# Altium schematic sheet Schematic_Rev2.SchDoc
size A4; Revision: 4; SheetNumber: 1; SheetTotal: 1
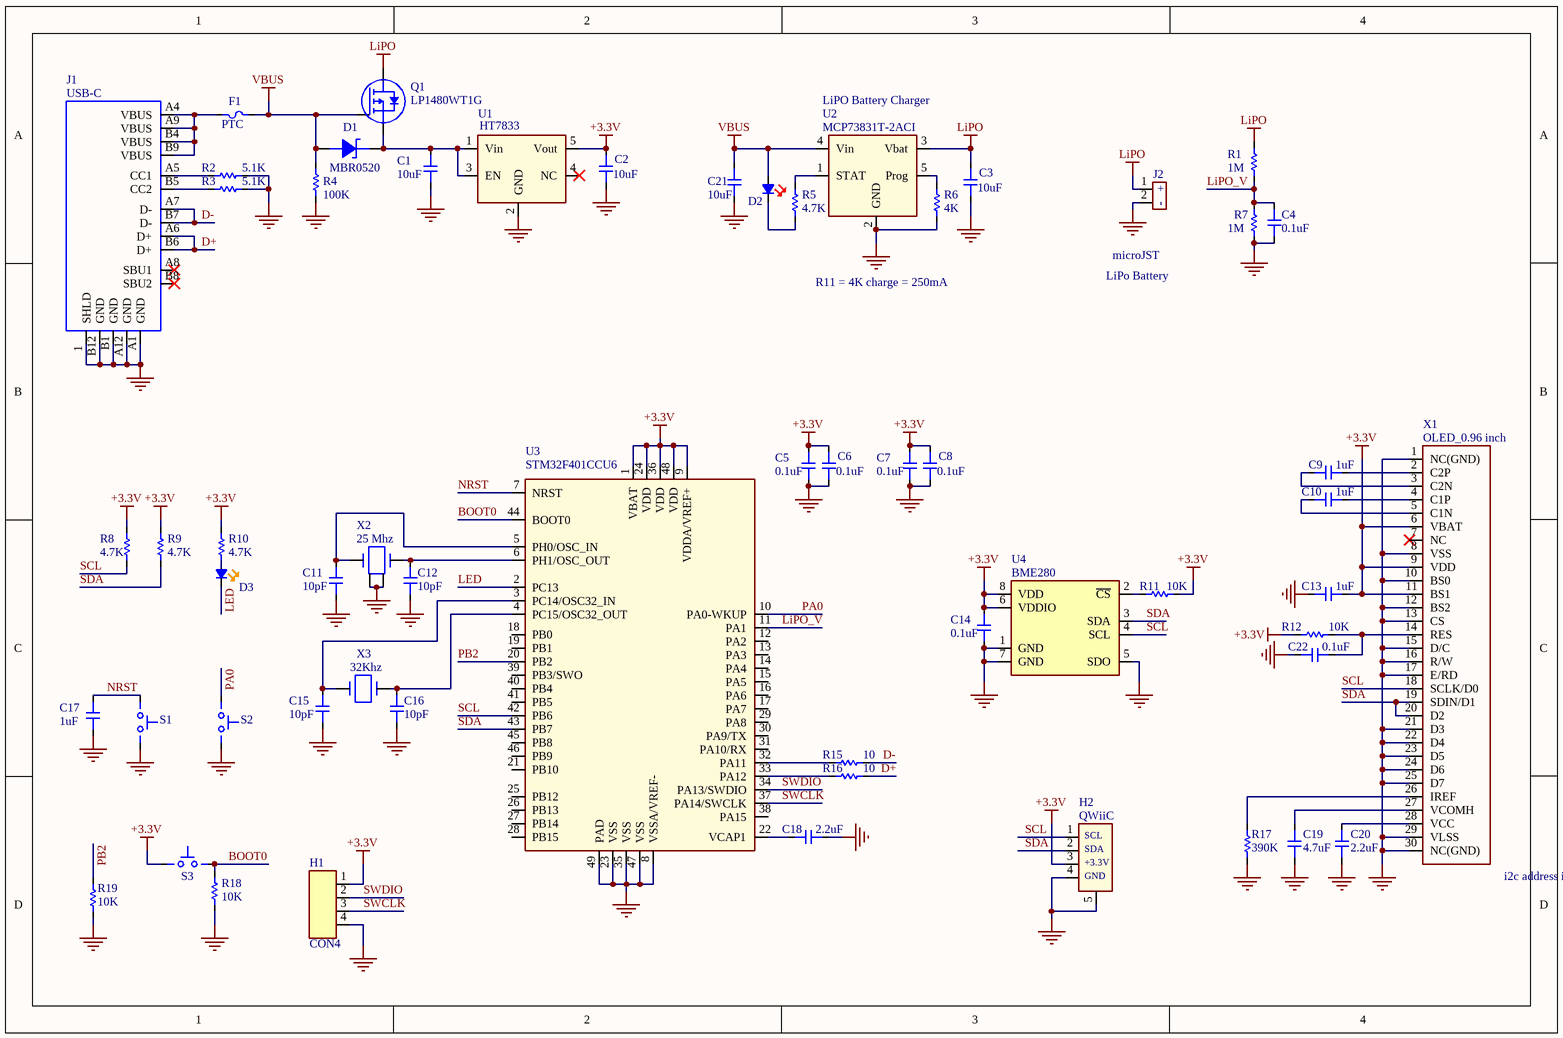
[diagram p0: Schematic_Rev2.SchDoc]

## Parts
C1  10uF  [CAPC2012X140N]
C2  10uF  [CAPC2012X140N]
C3  10uF  [CAPC2012X140N]
C4  0.1uF  [CAPC0603X56N]
C5  0.1uF  [CAPC1005X56N]
C6  0.1uF  [CAPC1005X56N]
C7  0.1uF  [CAPC1005X56N]
C8  0.1uF  [CAPC1005X56N]
C9  1uF  [CAPC1005X56N]
C10  1uF  [CAPC1005X56N]
C11  10pF  [CAPC0603X56N]
C12  10pF  [CAPC0603X56N]
C13  1uF  [CAPC1005X56N]
C14  0.1uF  [CAPC0603X56N]
C15  10pF  [CAPC0603X56N]
C16  10pF  [CAPC0603X56N]
C17  1uF  [CAPC1005X56N]
C18  2.2uF  [CAPC1608X09L]
C19  4.7uF  [CAPC1608X09L]
C20  2.2uF  [CAPC1608X09L]
C21  10uF  [CAPC2012X140N]
C22  0.1uF  [CAPC1005X56N]
D1  value MBR0520  [SOD123]  (hidden comment: MBR0520-TP)
D2  Red Led  [LED1005X40N-Red]  (value not drawn)
D3  (no value)  [LED1005X40N-Orange]
F1  PTC  [RESC1608X06L (0603 FOOTPRINT)]
H1  CON4  [HDR1X4-Empty]
H2  QWiiC  [SM04B-SRSS-TB]
J1  USB-C  [TYPE-C-31-M-12]
J2  CON2  [JST_Micro_2PIN]  (value not drawn)  (no BOM)
Q1  LP1480WT1G  [SC-70]
R1  1M  [RESC0603X40L (0201 footprint)]
R2  5.1K  [RESC0603X40L (0201 footprint)]
R3  5.1K  [RESC0603X40L (0201 footprint)]
R4  100K  [RESC0603X40L (0201 footprint)]
R5  4.7K  [RESC0603X40L (0201 footprint)]
R6  4K  [RESC0603X40L (0201 footprint)]
R7  1M  [RESC0603X40L (0201 footprint)]
R8  4.7K  [RESC0603X40L (0201 footprint)]
R9  4.7K  [RESC0603X40L (0201 footprint)]
R10  4.7K  [RESC0603X40L (0201 footprint)]
R11  10K  [RESC0603X40L (0201 footprint)]
R12  10K  [RESC0603X40L (0201 footprint)]
R15  10  [RESC0603X40L (0201 footprint)]
R16  10  [RESC0603X40L (0201 footprint)]
R17  390K  [RESC0603X40L (0201 footprint)]
R18  10K  [RESC0603X40L (0201 footprint)]
R19  10K  [RESC0603X40L (0201 footprint)]
S1  (no value)  [TS-1088R-02526]
S2  (no value)  [TS-1088R-02526]
S3  (no value)  [TS-1088R-02526]
U1  HT7833  [SOT95P280X144-5N]
U2  value MCP73831T-2ACI  [SOT95P280X144-5N]  (hidden comment: MCP73831T-2ACI/OT)
U3  STM32F401CCU6  [QFN48_NEWEST 0.5mm pitch]
U4  BME280  [LGA2.5X2.5-8N]
X1  OLED_0.96 inch  [OLED_GLASS 0.96 INCH_TOPSIDE]
X2  25 Mhz  [OSC20X16]
X3  32Khz  [TJXM32768K2TGDCNT2T]

## Nets
+3.3V: C2.1 C5.2 C6.2 C7.2 C8.2 C13.2 C14.1 H1.1 H2.3 R8.1 R9.1 R10.1 R11.2 R12.1 S3.1(A) U1.5(Vout) U3.1(VBAT) U3.9(VDDA/VREF+) U3.24(VDD) U3.36(VDD) U3.48(VDD) U4.6(VDDIO) U4.8(VDD) X1.6(VBAT) X1.9(VDD) X1.11(BS1)
GND: C1.2 C2.2 C3.2 C4.2 C5.1 C6.1 C7.1 C8.1 C11.2 C12.2 C13.1 C14.2 C15.2 C16.2 C17.1 C18.2 C19.1 C20.2 C21.2 C22.2 H1.4 H2.4 H2.5 J1.1(SHLD) J1.A1(GND) J1.A12(GND) J1.B1(GND) J1.B12(GND) J2.2 R2.1 R3.1 R4.2 R6.1 R7.1 R17.1 R18.2 R19.1 S1.2(B) S2.2(B) U1.2(GND) U2.2(GND) U3.8(VSSA/VREF-) U3.23(VSS) U3.35(VSS) U3.47(VSS) U3.49(PAD) U4.1(GND) U4.5(SDO) U4.7(GND) X1.1(NC(GND)) X1.8(VSS) X1.10(BS0) X1.12(BS2) X1.13(CS) X1.15(D/C) X1.16(R/W) X1.17(E/RD) X1.21(D3) X1.22(D4) X1.23(D5) X1.24(D6) X1.25(D7) X1.29(VLSS) X1.30(NC(GND)) X2.2 X2.4
LiPO: C3.1 J2.1 Q1.3(D) R1.2 U2.3(Vbat)
VBUS: C21.1 D1.2(Annode) D2.2 F1.1 Q1.1(G) R4.1 U2.4(Vin)
BOOT0: R18.1 S3.2(B) U3.44(BOOT0)
D+: J1.A6(D+) J1.B6(D+) R16.2
D-: J1.A7(D-) J1.B7(D-) R15.2
LED: D3.1 U3.2(PC13)
LiPO_V: C4.1 R1.1 R7.2 U3.11(PA1)
NRST: C17.2 S1.1(A) U3.7(NRST)
PA0: S2.1(A) U3.10(PA0-WKUP)
PB2: R19.2 U3.20(PB2)
SCL: H2.1 R8.2 U3.42(PB6) U4.4(SCL) X1.18(SCLK/D0)
SDA: H2.2 R9.2 U3.43(PB7) U4.3(SDA) X1.19(SDIN/D1) X1.20(D2)
SWCLK: H1.3 U3.37(PA14/SWCLK)
SWDIO: H1.2 U3.34(PA13/SWDIO)
NetC1_1: C1.1 D1.1(Cathode) Q1.2(S) U1.1(Vin) U1.3(EN)
NetC9_1: C9.1 X1.3(C2N)
NetC9_2: C9.2 X1.2(C2P)
NetC10_1: C10.1 X1.5(C1N)
NetC10_2: C10.2 X1.4(C1P)
NetC11_1: C11.1 U3.5(PH0/OSC_IN) X2.1
NetC12_1: C12.1 U3.6(PH1/OSC_OUT) X2.3
NetC15_1: C15.1 U3.3(PC14/OSC32_IN) X3.1
NetC16_1: C16.1 U3.4(PC15/OSC32_OUT) X3.2
NetC18_1: C18.1 U3.22(VCAP1)
NetC19_2: C19.2 X1.27(VCOMH)
NetC20_1: C20.1 X1.28(VCC)
NetC22_1: C22.1 R12.2 X1.14(RES)
NetD2_1: D2.1 R5.1
NetD3_2: D3.2 R10.2
NetF1_2: F1.2 J1.A4(VBUS) J1.A9(VBUS) J1.B4(VBUS) J1.B9(VBUS)
NetJ1_A5: J1.A5(CC1) R2.2
NetJ1_B5: J1.B5(CC2) R3.2
NetR5_2: R5.2 U2.1(STAT)
NetR6_2: R6.2 U2.5(Prog)
NetR11_1: R11.1 U4.2(~{CS})
NetR15_1: R15.1 U3.32(PA11)
NetR16_1: R16.1 U3.33(PA12)
NetR17_2: R17.2 X1.26(IREF)

Not connected (* = marked no-connect by the designer): J1 A8(SBU1)* B8(SBU2)*; U1 4(NC)*; U3 12(PA2) 13(PA3) 14(PA4) 15(PA5) 16(PA6) 17(PA7) 18(PB0) 19(PB1) 21(PB10) 25(PB12) 26(PB13) 27(PB14) 28(PB15) 29(PA8) 30(PA9/TX) 31(PA10/RX) 38(PA15) 39(PB3/SWO) 40(PB4) 41(PB5) 45(PB8) 46(PB9); X1 7(NC)*

## Notes on the sheet
- (near U2) LiPO Battery Charger
- R11 = 4K charge = 250mA
- LiPo Battery
- (near J2) microJST
- (near X1) i2c address is 0x3C
- (in symbol JST_Micro_CONN_2PIN) +; -
- (in symbol SM04B-SRSS-TB) SCL; SDA; +3.3V; GND

## Library data of the parts
C1-C3 C21 = CAP_0805: CAP 10uF 0805; Part_Footprint: 0805; Value: 10uF
C4 C11 C14 C15 = CAP_0201: CAP 0.1uF 0201; Part_Footprint: 0201
  C4 C14: Value: 0.1uF
  C11 C15: Value: 10pF
C5-C8 C22 = CAP_0402: CAP 0.1uF 0402; Part_Footprint: 0402; Value: 0.1uF
C9 C10 C13 C17 = CAP_0402: CAP 1uF 0402; Part_Footprint: 0402; Value: 1uF
C12 C16 = CAP_0201: CAP 10pF 0201; Part_Footprint: 0201; Value: 10pF
C18 C20 = CAP_0603: CAP 2.2uF 0603; Part_Footprint: 0603; Value: 2.2uF
C19 = CAP_0603: CAP 4.7uF 0603; Part_Footprint: 0603; Value: 4.7uF
D1 = MBR0520-TP: DIODE SCHOTTKY 20V 500MA SOD-123; Manufacturer: Micro; Part_Number: C78746; Vendor: LCSC; Part_Footprint: SOD-123
D2 = LED_0402_SMALL_Red: LED Red 0402; Part_Number: C364556; Manufacturer: Lite-On; Part_Footprint: 0402; Vendor: LCSC; Value: Red Led
D3 = LED_0402_SMALL_Orange: LED Orange 0402; Manufacturer: Lite-On; Part_Number: C364554; Part_Footprint: 0402; Vendor: LCSC
F1 = PTC_FUSE_0603: PTC FUSE 0.5mA hold, 1A trip 0603; Manufacturer: JDT Fuse; Part_Number: C2982257; Vendor: LCSC; Value: PTC
H1 = CON4: CONN HEADER 4POS .100" PADS; Part_Number: PADS
H2 = SM04B-SRSS-TB: CONN HEADER 4POS .100 R/A QWIIC; Manufacturer: JST; Part_Number: PRT-14417; Vendor: Digi-Key; Value: QWiiC
J1 = USB-C: CONN RECPT USB-C; Manufacturer: KHE; Part_Number: C165948; Part_Footprint: SMT; Vendor: LCSC; Value: USB-C
J2 = JST_Micro_CONN_2PIN: JST MIcro CONN 2POS
Q1 = LP1480WT1G: MOSFET P-CH 20V 1.4A SC-70; Manufacturer: LRC; Part_Number: C172434; Vendor: LCSC; Part_Footprint: SC-70; Value: LP1480WT1G
R1 R7 = RES_0201: RES 1M 0201; PartFootprint: 0201; Value: 1M
R2 R3 = RES_0201: RES 0201 5.1K; PartFootprint: 0201; Value: 5.1K
R4 = RES_0201: RES 100K 0201; PartFootprint: 0201; Value: 100K
R5 R8-R10 = RES_0201: RES 4.7K 0201; PartFootprint: 0201; Value: 4.7K
R6 = RES_0201: RES 4K 0201; PartFootprint: 0201; Value: 4K
R11 R12 R18 R19 = RES_0201: RES 10K 0201; PartFootprint: 0201; Value: 10K
R15 R16 = RES_0201: RES 10 0201; PartFootprint: 0201; Value: 10
R17 = RES_0201: RES 390K 0201; PartFootprint: 0201; Value: 390K
S1-S3 = TS-1088R-02526: Tactile Micro Switch; Part_Number: C455281; Manufacturer: XUNPU; Part_Footprint: SMD; Vendor: LCSC
U1 = HT7833: IC LDO 3.3V 0.5A SOT23-5; Manufacturer: Holtek; Part_Number: C164106; Vendor: LCSC; Value: HT7833; Part_Footprint: SOT23-5
U2 = MCP73831T-2ACI/OT: Charger IC Lithium-Ion/Polymer SOT23-5; Manufacturer: Microchip; Vendor: Digi-Key; Part_Number: MCP73831T-2ACI/OT
U3 = STM32F401CCU6: IC MCU 32BIT 256KB FLASH 48LQFN; Manufacturer: ST Micro; Part_Footprint: 48LQFN; Part_Number: STM32F401CCU6; Value: STM32F401CCU6
U4 = BME280: Gas, Humidity, Pressure, Temperature Sensor I2C,; Manufacturer: Bosch; Part_Footprint: 8LGA; Vendor: Digi-Key; Part_Number: BME280; Value: BME280
X1 = OLED_GLASS 0.96 inch: 0.96 inch OLED_GLASS; Part_Number: ER-OLED0.96-3W; Manufacturer: Buy-Display; Vendor: Buy-Display; Value: *; Part_Footprint: *
X2 = 25Mhz: CRYSTAL 25MHZ 10PF SMD; Part_Number: ECS-250-10-37B2-CTN-TR; Manufacturer: ECS; Vendor: Digi-Key; Value: 25 Mhz
X3 = TJXM32768K2TGDCNT2T: CRYSTAL 32.768 KHZ 12.5PF SMD; Manufacturer: TAE; Vendor: LCSC; Part_Number: TJXM32768K2TGDCNT2T; Value: 32Khz